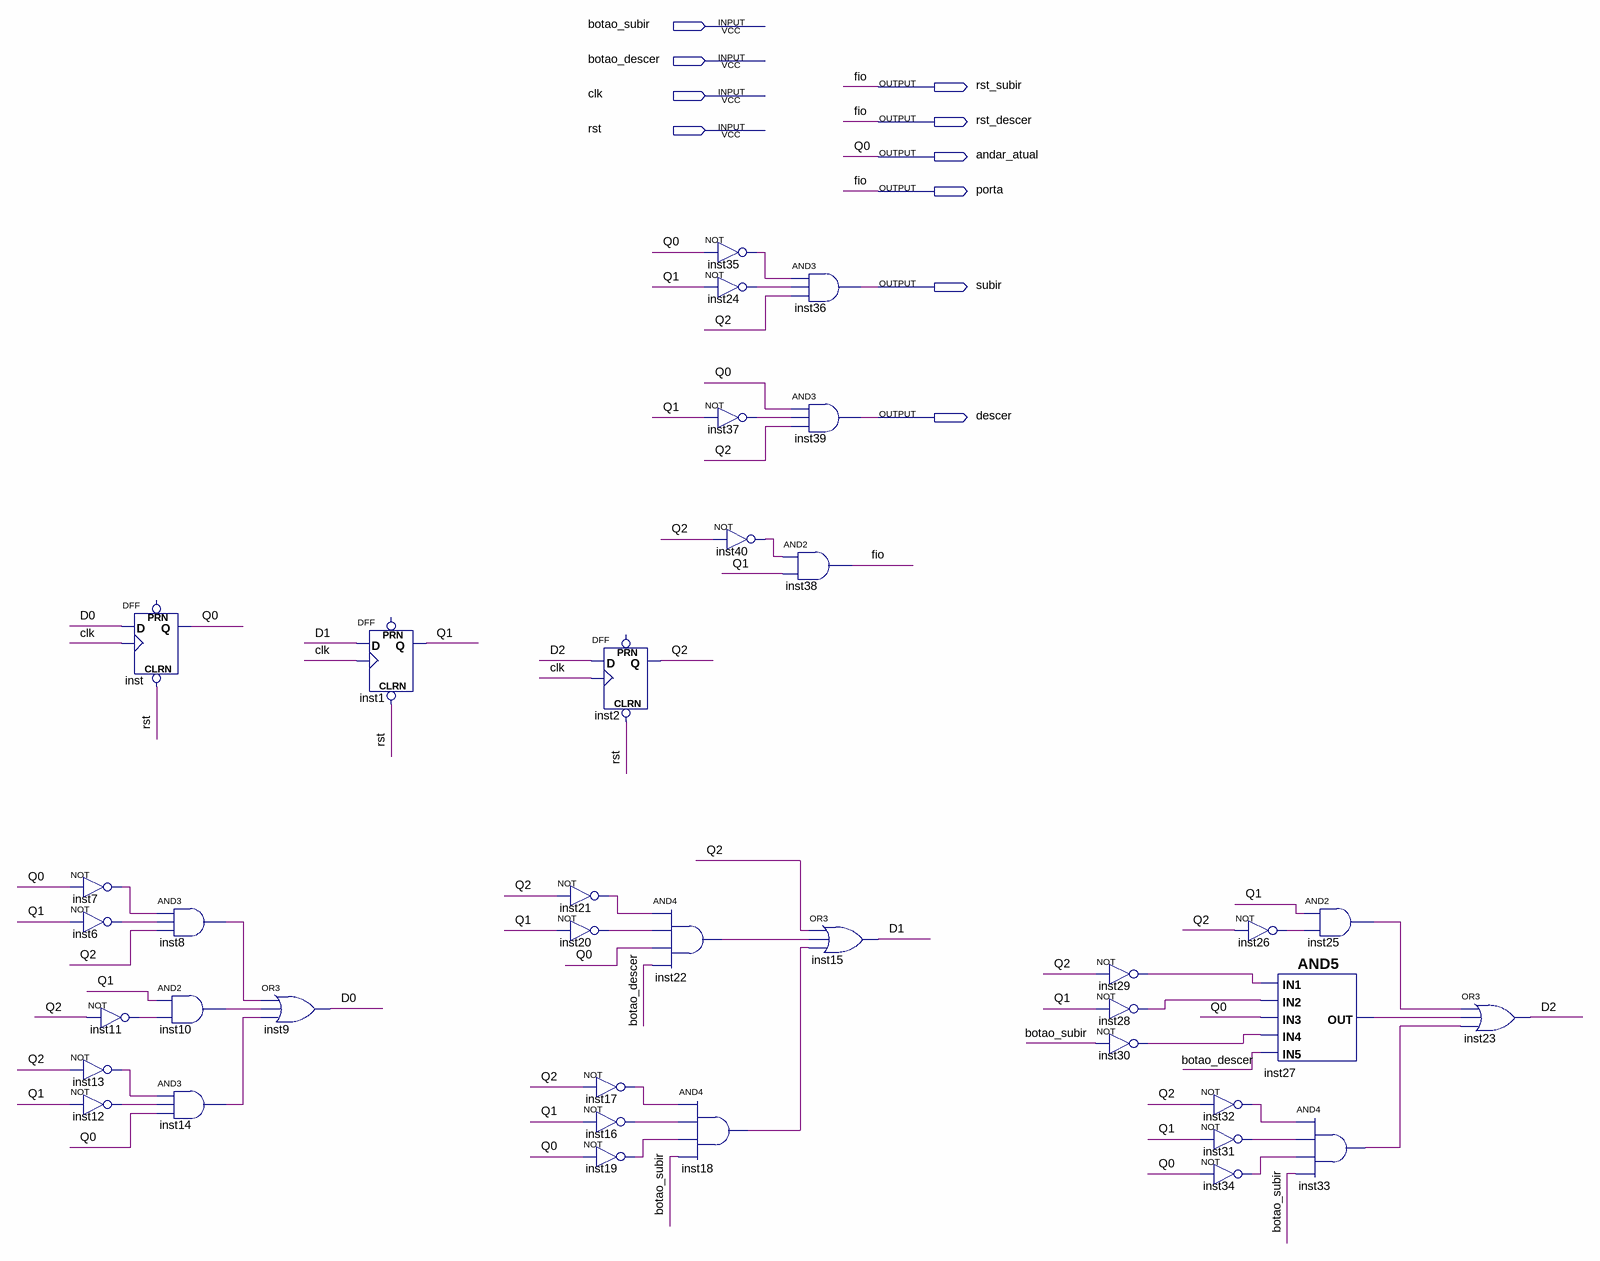
[diagram p0: schematic sheet]
// Quartus schematic controlador.bdf as structural Verilog: 38 symbols, 10 pins
module controlador (
  input  botao_subir,
  input  botao_descer,
  input  clk,
  input  rst,
  output rst_subir,
  output rst_descer,
  output andar_atual,
  output porta,
  output subir,
  output descer
);

  wire D0, D1, D2, inst6_out, inst7_out, inst8_out, inst10_out, inst11_out, inst12_out, inst13_out,
       inst14_out, inst16_out, inst17_out, inst18_out, inst19_out, inst20_out, inst21_out, inst22_out,
       inst24_out, inst25_out, inst26_out, inst27_out, inst28_out, inst29_out, inst30_out, inst31_out,
       inst32_out, inst33_out, inst34_out, inst35_out, inst37_out, inst40_out, Q1, Q2;

  not inst7 (inst7_out, andar_atual);
  not inst6 (inst6_out, Q1);
  not inst13 (inst13_out, Q2);
  not inst12 (inst12_out, Q1);
  DFF inst (.CLRN(rst), .CLK(clk), .D(D0), .Q(andar_atual));  // open: PRN
  not inst11 (inst11_out, Q2);
  and inst8 (inst8_out, inst7_out, inst6_out, Q2);
  and inst10 (inst10_out, Q1, inst11_out);
  and inst14 (inst14_out, inst13_out, inst12_out, andar_atual);
  or inst9 (D0, inst8_out, inst10_out, inst14_out);
  DFF inst1 (.CLRN(rst), .CLK(clk), .D(D1), .Q(Q1));  // open: PRN
  not inst21 (inst21_out, Q2);
  not inst20 (inst20_out, Q1);
  DFF inst2 (.CLRN(rst), .CLK(clk), .D(D2), .Q(Q2));  // open: PRN
  not inst17 (inst17_out, Q2);
  not inst16 (inst16_out, Q1);
  not inst19 (inst19_out, andar_atual);
  not inst35 (inst35_out, andar_atual);
  not inst24 (inst24_out, Q1);
  not inst37 (inst37_out, Q1);
  and inst22 (inst22_out, inst21_out, inst20_out, andar_atual, botao_descer);
  and inst18 (inst18_out, inst17_out, inst16_out, inst19_out, botao_subir);
  not inst40 (inst40_out, Q2);
  and inst36 (subir, inst35_out, inst24_out, Q2);
  and inst39 (descer, andar_atual, inst37_out, Q2);
  and inst38 (porta, inst40_out, Q1);
  or inst15 (D1, Q2, inst22_out, inst18_out);
  not inst29 (inst29_out, Q2);
  not inst28 (inst28_out, Q1);
  not inst30 (inst30_out, botao_subir);
  not inst26 (inst26_out, Q2);
  and inst27 (inst27_out, inst29_out, inst28_out, andar_atual, inst30_out, botao_descer);
  not inst32 (inst32_out, Q2);
  not inst31 (inst31_out, Q1);
  not inst34 (inst34_out, andar_atual);
  and inst25 (inst25_out, Q1, inst26_out);
  and inst33 (inst33_out, inst32_out, inst31_out, inst34_out, botao_subir);
  or inst23 (D2, inst25_out, inst27_out, inst33_out);

  assign rst_descer = porta;
  assign rst_subir = porta;

  // Other names for the same wires on the sheet: fio = porta; Q0 = andar_atual
endmodule
